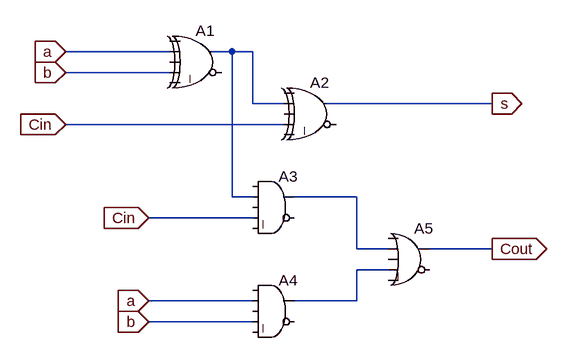
[diagram p0: schematic Full_Adder_Vertical.asc]
Full_Adder_Vertical.asc, the LTspice schematic file:
Version 4
SHEET 1 880 680
WIRE 48 48 -112 48
WIRE 144 48 112 48
WIRE 176 48 144 48
WIRE 48 80 -112 80
WIRE 176 128 176 48
WIRE 224 128 176 128
WIRE 544 128 288 128
WIRE 224 160 -112 160
WIRE 144 272 144 48
WIRE 176 272 144 272
WIRE 336 272 240 272
WIRE 176 304 16 304
WIRE 336 352 336 272
WIRE 384 352 336 352
WIRE 544 352 448 352
WIRE 384 384 336 384
WIRE 176 432 16 432
WIRE 336 432 336 384
WIRE 336 432 240 432
WIRE 176 464 16 464
FLAG -112 48 a
IOPIN -112 48 In
FLAG -112 80 b
IOPIN -112 80 In
FLAG -112 160 Cin
IOPIN -112 160 In
FLAG 16 304 Cin
IOPIN 16 304 In
FLAG 16 432 a
IOPIN 16 432 In
FLAG 16 464 b
IOPIN 16 464 In
FLAG 544 128 s
IOPIN 544 128 Out
FLAG 544 352 Cout
IOPIN 544 352 Out
SYMBOL Digital\\xor 96 0 R0
SYMATTR InstName A1
SYMBOL Digital\\xor 272 80 R0
SYMATTR InstName A2
SYMBOL Digital\\and 208 224 R0
SYMATTR InstName A3
SYMBOL Digital\\and 208 384 R0
SYMATTR InstName A4
SYMBOL Digital\\or 416 304 R0
SYMATTR InstName A5

The netlist it stands for:
* Full_Adder_Vertical.asc
A1 0 a 0 b 0 0 N001 0 XOR
A2 0 N001 0 Cin 0 0 s 0 XOR
A3 0 N001 0 Cin 0 0 N002 0 AND
A4 0 a 0 b 0 0 N003 0 AND
A5 0 N002 0 N003 0 0 Cout 0 OR
.backanno
.end